# EAGLE design microsd (EAGLE 9.1.0)

## Sheet 1 of 2
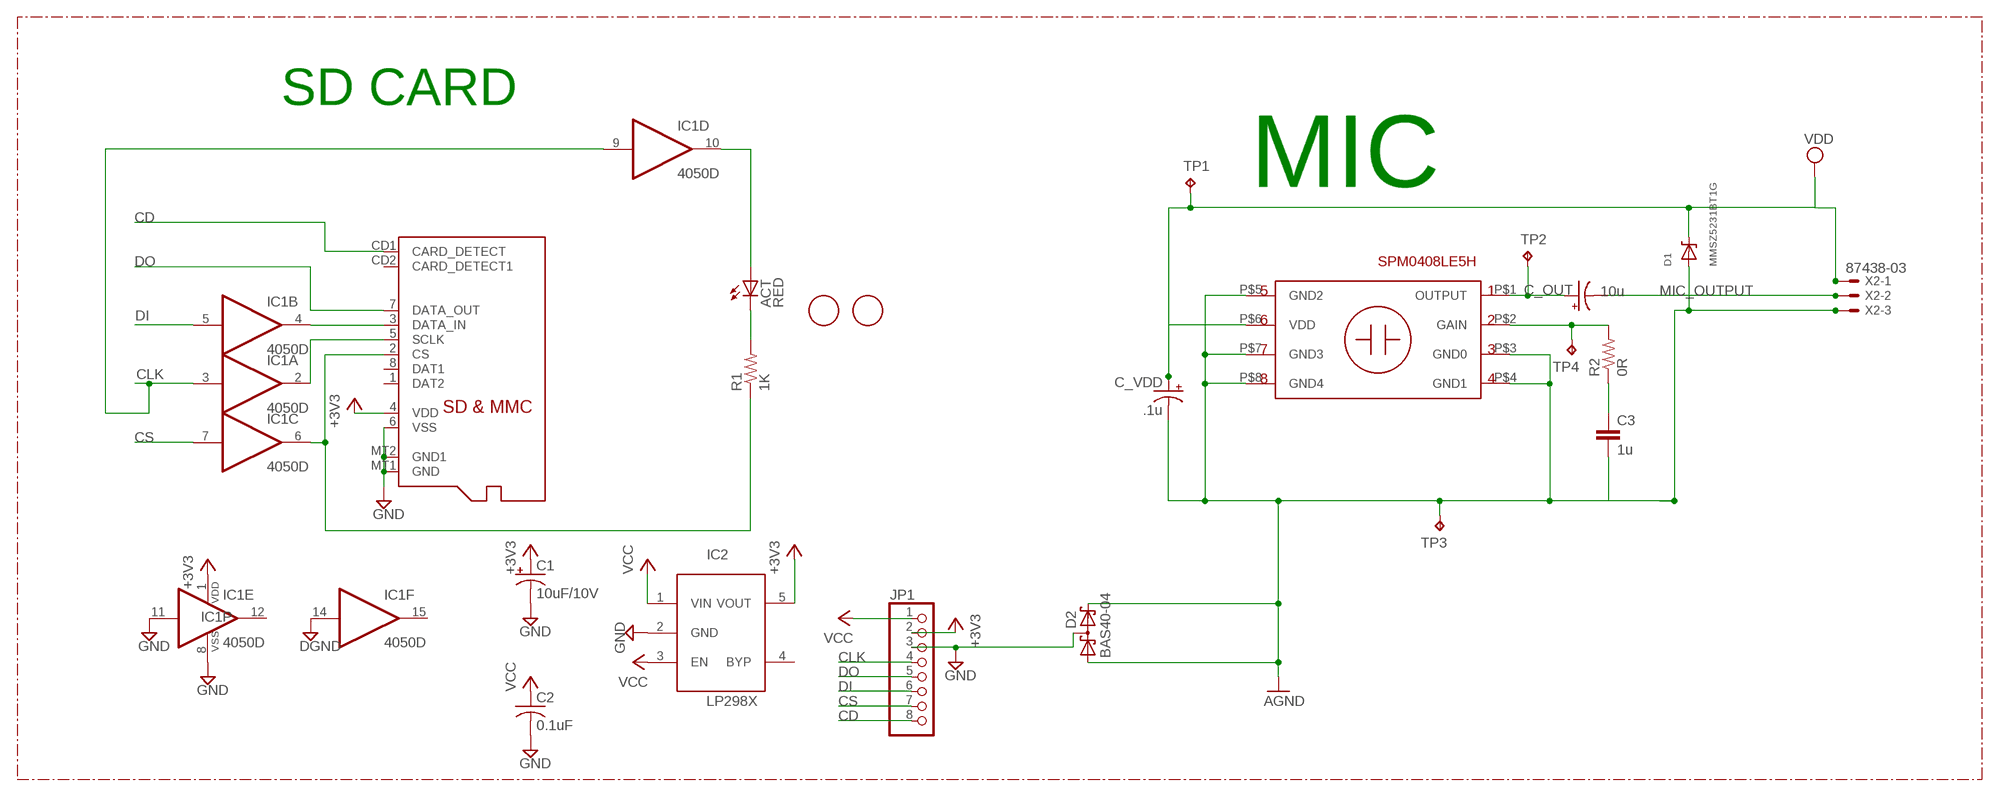
[diagram p0: schematic, sheet 1]

### Parts
ACT  RED  LEDCHIP-LED0805  [CHIP-LED0805]
C1  10uF/10V  CPOL-USA/3216-18R  [A/3216-18R]
C2  0.1uF  C-USC0805K  [C0805K]
C3  1u  CAP_0402  [0402]
C_OUT  10u  CAP_POL1206-KIT  [EIA3216-KIT]
C_VDD  .1u  CAP_POL1206-KIT  [EIA3216-KIT]
D1  MMSZ5231BT1G  DIODE-ZENERSOD123  [SOD-123]
D2  BAS40-04  [SOT23]
IC1  4050D  [SO16]
IC2  LP298XS  [SOT23-5L]
JP1  PINHD-1X8BIG  [1X08-BIG]
R1  1K  R-US_R0805  [R0805]
R2  0R  RES_0402  [0402]
TP1  TPPAD1-17  [P1-17]
TP2  TPPAD1-17  [P1-17]
TP3  TPPAD1-17  [P1-17]
TP4  TPPAD1-17  [P1-17]
U2  SPM0408LE5H  [SPM0408LE5H-TB]
U$1  FIDUCIAL  [FIDUCIAL_1MM]
U$2  FIDUCIAL  [FIDUCIAL_1MM]
X1  MICROSD  [MICROSD]
X2  87438-03  [87438-03]

### Nets
+3V3: C1.+ IC1.1(P:VDD) IC2.5(VOUT) JP1.2 X1.4(VDD)
AGND: C3.2 C_VDD.C(-) D1.A D2.1(A1) D2.2(C2) TP3.TP U2.P$3(GND0) U2.P$4(GND1) U2.P$5(GND2) U2.P$7(GND3) U2.P$8(GND4) X2.3
CD: JP1.8 X1.CD1(CARD_DETECT)
CLK: IC1.3(A:I) IC1.9(D:I) JP1.4
CS: IC1.7(C:I) JP1.7
DI: IC1.5(B:I) JP1.6
DO: JP1.5 X1.7(DATA_OUT)
GND: C1.- C2.2 D2.3(C1A2) IC1.8(P:VSS) IC1.11(E:I) IC1.14(F:I) IC2.2(GND) JP1.3 X1.6(VSS) X1.MT1(GND) X1.MT2(GND1) ; supply symbol labelled DGND
MIC_OUTPUT: C_OUT.C(-) X2.2
N$1: ACT.A IC1.10(D:O)
N$2: IC1.2(A:O) X1.5(SCLK)
N$3: IC1.6(C:O) R1.1 X1.2(CS)
N$4: ACT.C R1.2
N$5: IC1.4(B:O) X1.3(DATA_IN)
N$8: C_OUT.A(+) TP2.TP U2.P$1(OUTPUT)
N$35: R2.2 TP4.TP U2.P$2(GAIN)
N$36: C3.1 R2.1
VCC: C2.1 IC2.1(VIN) IC2.3(EN) JP1.1
VDD: C_VDD.A(+) D1.C TP1.TP U2.P$6(VDD) X2.1
Unconnected: IC1.12(E:O) IC1.15(F:O) IC2.4(BYP) X1.1(DAT2) X1.8(DAT1) X1.CD2(CARD_DETECT1)

### Notes on the sheet
- SD CARD
- MIC
- SPM0408LE5H

## Sheet 2 of 2

## Library data of the parts
ACT = adafruit:LED: LED OSRAM: - CHIPLED LG R971, LG N971, LY N971, LG Q971, LY Q971, LO R971, LY R971 LH N974, LH R974 LS Q976, LO Q976, LY Q976 LO Q996 - Hyper CHIPLED LW Q18S LB Q993, LB Q99A, LB R99A - SideLED LS A670, LO A670, LY A670, LG A670, LP A670 LB A673, LV A673, LT A673, LW A673 LH A674 LY A675 LS A676, LA A676, LO A676, LY A676, LW A676 LS A679, LY A679, LG A679 - Hyper Micro SIDELED® LS Y876, LA Y876, LO Y876, LY Y876 LT Y87S - SmartLED LW L88C, LW L88S LB L89C, LB L89S, LG L890 LS L89K, LO L89K, LY L89K LS L896, LA L896, LO L896, LY L896 - TOPLED LS T670, LO T670, LY T670, LG T670, LP T670 LSG T670, LSP T670, LSY T670, LOP T670, LYG T670 LG T671, LOG T671, LSG T671 LB T673, LV T673, LT T673, LW T673 LH T674 LS T676, LA T676, LO T676, LY T676, LB T676, LH T676, LSB T676, LW T676 LB T67C, LV T67C, LT T67C, LS T67K, LO T67K, LY T67K, LW E67C LS E67B, LA E67B, LO E67B, LY E67B, LB E67C, LV E67C, LT E67C LW T67C LS T679, LY T679, LG T679 LS T770, LO T770, LY T770, LG T770, LP T770 LB T773, LV T773, LT T773, LW T773 LH T774 LS E675, LA E675, LY E675, LS T675 LS T776, LA T776, LO T776, LY T776, LB T776 LHGB T686 LT T68C, LB T68C - Hyper Mini TOPLED® LB M676 - Mini TOPLED Santana® LG M470 LS M47K, LO M47K, LY M47K Source: http://www.osram.convergy.de/
C1 = adafruit:CPOL-US: POLARIZED CAPACITOR, American symbol
C2 = adafruit:C-US: CAPACITOR, American symbol
C3 = Perfect_0402:CAP_0402: 0402 (1005 Metric) Nick Garner - TeleSense
C_OUT = SparkFun-Passives:CAP_POL: Capacitor Polarized These are standard SMD and PTH capacitors. Normally 10uF, 47uF, and 100uF in electrolytic and tantalum varieties. Always verify the external diameter of the through hole cap, it varies with capacity, voltage, and manufacturer. The EIA devices should be standard.; MF: AVX; MPN: 0603ZD106MAT2A; OC_FARNELL: 1867954
C_VDD = SparkFun-Passives:CAP_POL: Capacitor Polarized These are standard SMD and PTH capacitors. Normally 10uF, 47uF, and 100uF in electrolytic and tantalum varieties. Always verify the external diameter of the through hole cap, it varies with capacity, voltage, and manufacturer. The EIA devices should be standard.; MF: VISHAY SPRAGUE; MPN: 293D106X96R3A2TE3; OC_FARNELL: 1754143
D1 = microbuilder:DIODE-ZENER: Zener Diode SMA: 30V 1W Zener Diode, 1.2Vf - Digikey: SMAZ30-FDICT-ND
D2 = diode:BAS40-04: Silicon Schottky Diodes General-purpose diode for high-speed switching
IC1 = 40xx:4050: Hex non-inverting BUFFER
IC2 = adafruit:LP298X
JP1 = adafruit:PINHD-1X8: PIN HEADER
R1 = adafruit:R-US_: RESISTOR, American symbol
R2 = Perfect_0402:RES_0402: 0402 (1005 Metric) Nick Garner - TeleSense
TP1-TP4 = testpad:TP: Test pad
U2 = acousticLib:SPM0408LE5H
U$1 U$2 = adafruit:FIDUCIAL: For use by pick and place machines to calibrate the vision/machine, 1mm By microbuilder.eu
X1 = adafruit:MICROSD: Micro-SD / Transflash card holder with SPI pinout For the 3M # 2908-05WB-MG and/or 4UCON #19656 push-push type
X2 = con-molex:87438-03: Wire-to-Board 1.50mm (.059") Pitch Header - Right Angle, SMT, Shrouded Source: http://www.molex.com/product/micro/87438.html; MF: MOLEX; OC_FARNELL: 1711328; OC_NEWARK: unknown

## Net classes
0 default: width 0.152 mm, drill 0.305 mm, clearance 0.152 mm

## Board
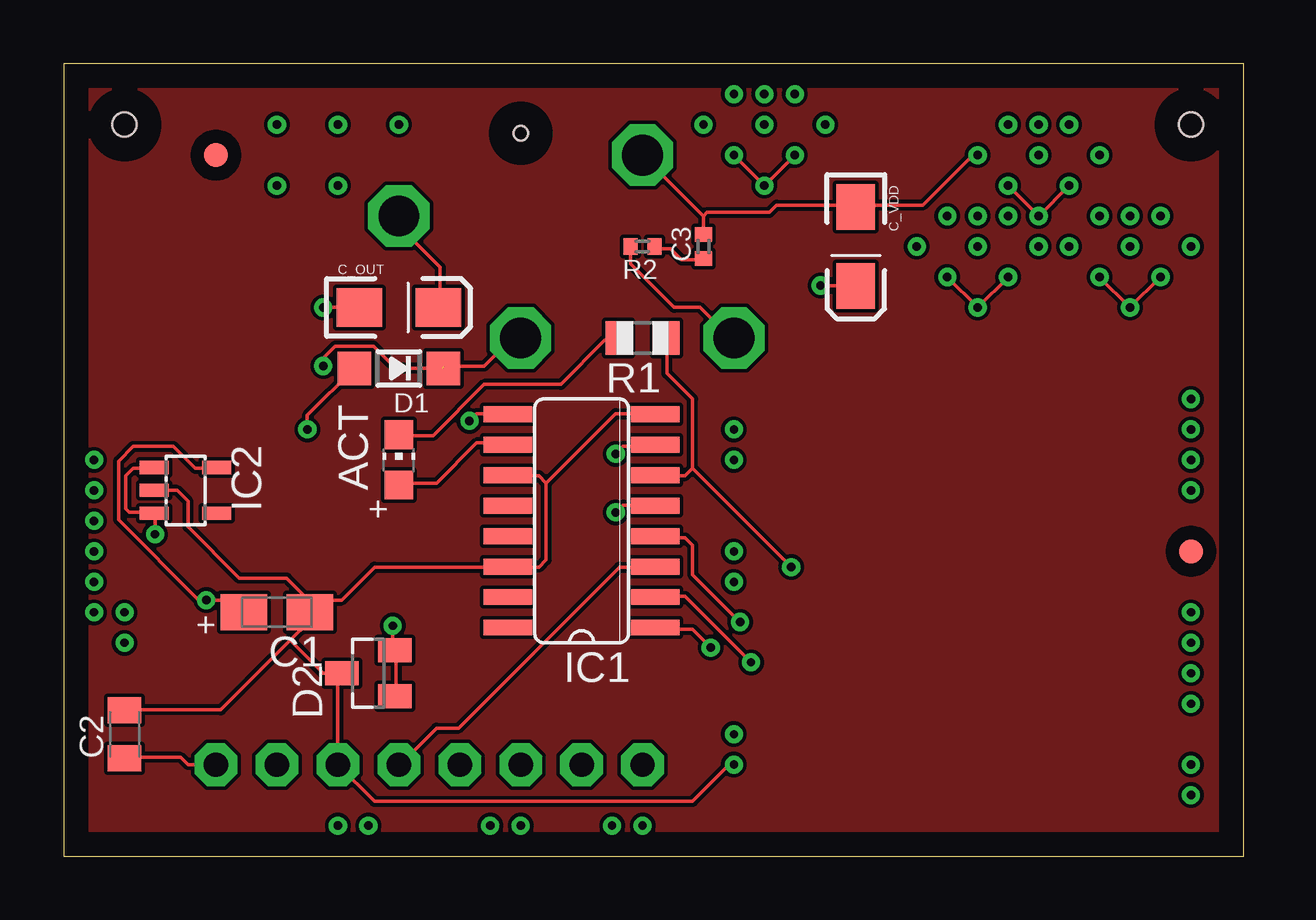
[diagram p1: board, top side]
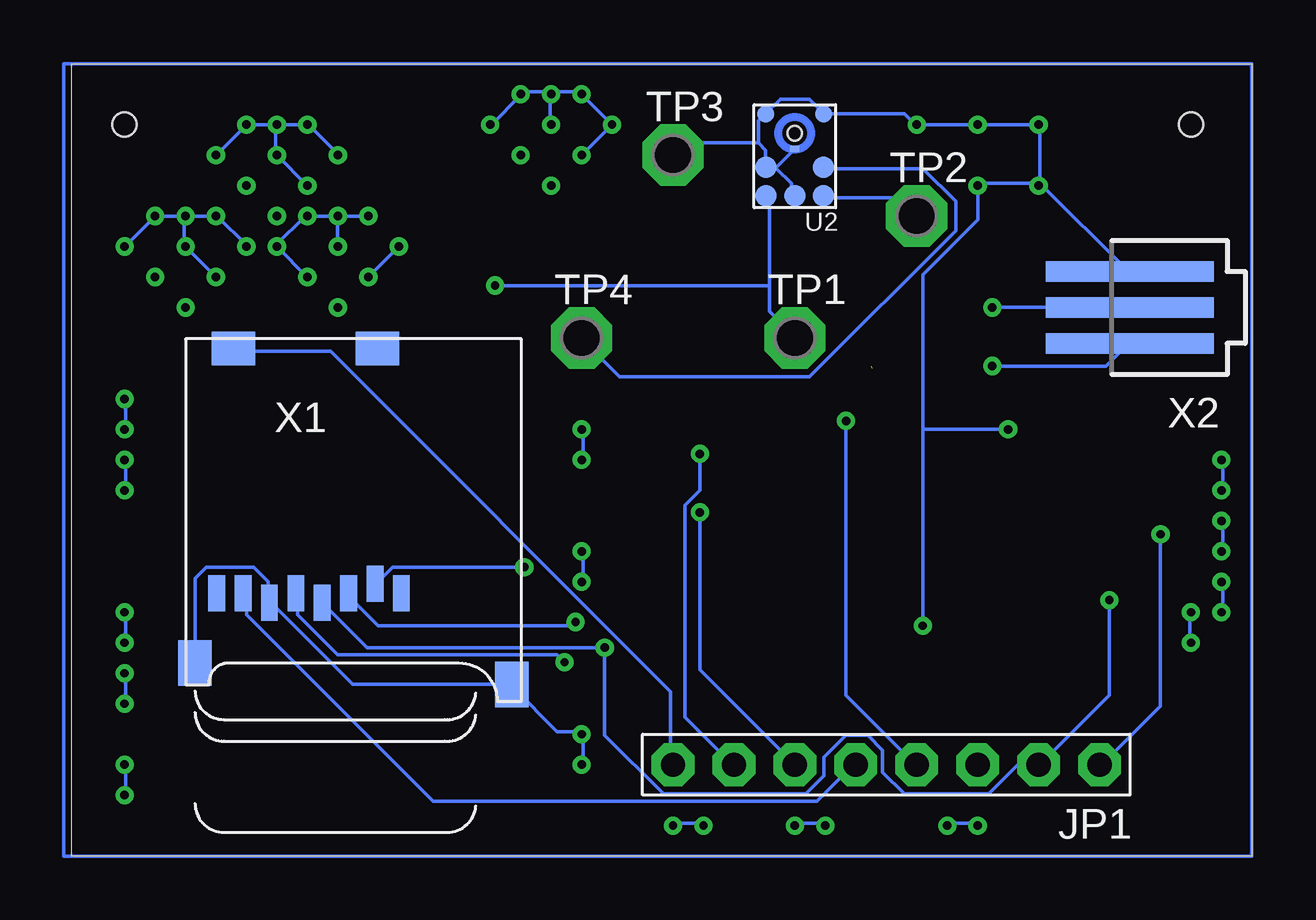
[diagram p2: board, bottom side, seen from below]

Size 49.2 x 33.01 mm. Coordinates in mm from the lower left corner, seen from the top.
Outline: 0,0 49.2,0 49.2,33.01 0,33.01 0,0
Copper layers (1*16): Top 0.035mm / dielectric 1.5mm / Bottom 0.035mm
Design rules "default": minimum track width 6mil, minimum drill 0.35mm, track to track 6mil, track to pad 6mil, pad to pad 6mil, via to via 6mil, smd to smd 6mil, copper to edge 40mil, drill to drill 6mil, minimum pad ring 10mil, minimum via ring 8mil, stop-mask expansion 4mil, vias tented up to drill 0mil, thermal gap 10mil
Holes 1 mm at 46.99,30.48 2.54,30.48

### Footprints (pad centres in the part's own frame; a part is rotated, then mirrored left to right if it is on the bottom)
CHIP-LED0805 = smd 1.2 x 1.2: A 0,-1.05; C 0,1.05
A/3216-18R = smd 1.95 x 1.5: + 1.375,0; - -1.375,0
C0805K = smd 1.1 x 1.4: 1 -1,0; 2 1,0
0402 = smd 0.6 x 0.7: 1 -0.5,0; 2 0.5,0
EIA3216-KIT = smd 1.9 x 1.6: A 1.65,0; C -1.65,0
SOD-123 = smd 1.4 x 1.4: A 1.85,0; C -1.85,0
SOT23 = smd 1 x 1.4: 1 -0.95,-1.1; 2 0.95,-1.1; 3 0,1.1
SO16 = smd 0.66 x 2.032: 1 -4.445,-3.073; 2 -3.175,-3.073; 3 -1.905,-3.073; 4 -0.635,-3.073; 5 0.635,-3.073; 6 1.905,-3.073; 7 3.175,-3.073; 8 4.445,-3.073; 9 4.445,3.073; 10 3.175,3.073; 11 1.905,3.073; 12 0.635,3.073; 13 -0.635,3.073; 14 -1.905,3.073; 15 -3.175,3.073; 16 -4.445,3.073
SOT23-5L = smd 0.55 x 1.2: 1 -0.95,-1.3; 2 0,-1.3; 3 0.95,-1.3; 4 0.95,1.3; 5 -0.95,1.3
1X08-BIG = drill 1.016 pad 1.778 octagon: 1 -8.89,0; 2 -6.35,0; 3 -3.81,0; 4 -1.27,0; 5 1.27,0; 6 3.81,0; 7 6.35,0; 8 8.89,0
R0805 = smd 1.1 x 1.4: 1 -1,0; 2 1,0
P1-17 = drill 1.702 pad 2.54 octagon: TP 0,0
SPM0408LE5H-TB = smd 0.9 x 0.9: P$1 -1.2,1.7; P$2 -1.2,0.506; P$5 1.208,0.506; P$6 1.208,1.7; P$7 0.004,1.7 | smd 0.7 x 0.7: P$3 -1.2,-1.706; P$4 1.208,-1.706 | smd 0.406 x 0.203: P$8 0,-0.26 | hole 0.6: 0.004,-0.916
FIDUCIAL_1MM = smd 1 x 1: 1 0,0
MICROSD = smd 0.7 x 1.5: 1 9,-10.64; 2 7.9,-10.24; 3 6.8,-10.64; 4 5.7,-11.04; 5 4.6,-10.64; 6 3.5,-11.04; 7 2.4,-10.64; 8 1.3,-10.64 | smd 1.8 x 1.4: CD1 2,-0.44; CD2 8,-0.44 | smd 1.4 x 1.9: MT1 0.4,-13.54; MT2 13.6,-14.44
87438-03 = smd 7 x 0.85: 1 0,1.5; 2 0,0; 3 0,-1.5

### Placement (x,y rotation side)
ACT  13.97,16.51 0 top
C1  8.89,10.16 180 top
C2  2.54,5.08 90 top
C3  26.67,25.4 90 top
C_OUT  13.97,22.86 0 top
C_VDD  33.02,25.4 270 top
D1  13.97,20.32 180 top
D2  12.7,7.62 90 top
IC1  21.59,13.97 90 top
IC2  5.08,15.24 270 top
JP1  15.24,3.81 180 bottom
R1  24.13,21.59 180 top
R2  24.13,25.4 180 top
TP1  19.05,21.59 0 bottom
TP2  13.97,26.67 0 bottom
TP3  24.13,29.21 0 bottom
TP4  27.94,21.59 0 bottom
U2  19.05,29.21 180 bottom
U$1  6.35,29.21 0 top
U$2  46.99,12.7 0 top
X1  44.45,21.59 0 bottom
X2  5.08,22.86 180 bottom

### Tracks (layer width: path | path; a pad name or v marks a point on that pad's centre or on a via)
+3V3  (via drill 0.35)
  Top 0.152: IC2.5 6.25,16.15 5.49,16.15 4.57,17.07 2.9,17.07 2.29,16.46 2.29,14.02 5.64,10.67 v5.94,10.67 7.01,10.67 7.47,10.21 C1.+ | v26.98,8.69 26.21,9.45 24.69,9.45 IC1.1
  Bottom 0.152: X1.4 38.71,10.52 36.88,8.69 v26.98,8.69 26.98,5.03 24.54,2.59 18.59,2.59 17.83,3.35 17.83,4.12 16.92,5.03 16,5.03 15.39,4.42 15.39,3.5 14.48,2.59 10.97,2.59 9.75,3.81 JP1.2 8.84,3.81 5.94,6.71 v5.94,10.67
AGND  (via drill 0.35)
  Top 0.152: v39.37,27.94 v40.64,26.67 v41.91,27.94 | v38.1,29.21 38.1,29.11 37.8,29.11 35.81,27.13 33.07,27.13 C_VDD.C 32.92,27.13 29.72,27.13 29.41,26.82 26.82,26.82 26.67,26.67 | 26.67,26.67 C3.2 | TP3.TP 26.67,26.67 | D2.1 13.87,6.71 13.87,8.53 D2.2 13.72,8.69 v13.72,9.6 | D1.A 10.16,18.36 v10.16,17.78
  Bottom 0.152: U2.P$8 19.82,28.7 U2.P$5 | v43.18,29.21 v41.91,30.48 40.69,30.48 | 40.69,30.48 40.69,29.26 v40.64,29.21 v39.37,27.94 | v38.1,29.21 38.1,29.26 39.32,30.48 v39.37,30.48 v40.64,30.48 40.69,30.48 | U2.P$7 19.2,27.58 19.2,28.04 19.81,28.65 U2.P$5 | 17.83,30.94 18.44,31.55 19.66,31.55 20.27,30.94 | 20.57,29.72 20.27,29.41 20.27,28.8 U2.P$5 | 20.57,29.72 20.57,30.63 20.27,30.94 | 20.27,30.94 U2.P$4 | 20.57,29.72 23.62,29.72 TP3.TP | 8.84,28.04 8.84,30.48 v8.89,30.48 v11.43,30.48 v13.97,30.48 14.02,30.48 14.48,30.94 17.83,30.94 | 13.72,17.78 13.72,24.23 11.43,26.52 v11.43,27.94 11.43,28.04 8.99,28.04 v8.89,27.94 8.84,28.04 | 13.72,17.78 v13.72,9.6 | 8.84,28.04 5.18,24.38 X2.3 | 17.83,30.94 U2.P$3 | v10.16,17.78 13.72,17.78
AGND1  (via drill 0.35)
  Top 0.152: v43.18,24.13 v44.45,22.86 v45.72,24.13
  Bottom 0.152: v46.99,25.4 v45.72,26.67 44.5,26.67 | 44.5,26.67 44.5,25.45 v44.45,25.4 v43.18,24.13 | v41.91,25.4 41.91,25.45 43.13,26.67 v43.18,26.67 v44.45,26.67 44.5,26.67
AGND2  (via drill 0.35)
  Top 0.152: v36.83,24.13 v38.1,22.86 v39.37,24.13
  Bottom 0.152: v38.1,26.67 v38.1,25.4 | v38.1,26.67 v36.83,26.67 | v38.1,26.67 v39.37,26.67 39.47,26.67 40.69,25.45 v40.64,25.4 v39.37,24.13 | v36.83,24.13 v35.56,25.4
AGND3  (via drill 0.35)
  Top 0.152: v27.94,29.21 v29.21,27.94 v30.48,29.21
  Bottom 0.152: v31.75,30.48 31.7,30.48 30.48,31.7 v30.48,31.75 30.48,31.85 29.26,31.85 v29.21,31.75 | v29.21,30.48 29.26,30.48 29.26,31.7 v29.21,31.75 | v29.21,31.75 29.11,31.85 28.04,31.85 v27.94,31.75 v26.67,30.48 v27.94,29.21
CD
  Bottom 0.152: X1.CD1 42.37,21.03 38.41,21.03 24.23,6.86 24.23,3.81 JP1.8
CLK  (via drill 0.35)
  Top 0.152: IC1.3 24.54,12.04 23.16,12.04 16.46,5.33 15.54,5.33 14.02,3.81 JP1.4 | v16.92,18.14 17.22,18.44 18.44,18.44 IC1.9
  Bottom 0.152: v16.92,18.14 16.92,6.71 14.02,3.81 JP1.4
CS  (via drill 0.35)
  Top 0.152: v23.01,16.76 23.32,17.07 24.54,17.07 IC1.7
  Bottom 0.152: v23.01,16.76 23.01,15.24 23.62,14.63 23.62,5.79 21.64,3.81 JP1.7
DI  (via drill 0.35)
  Top 0.152: v23.01,14.33 23.32,14.63 24.54,14.63 IC1.5
  Bottom 0.152: v23.01,14.33 23.01,7.77 JP1.6
DO
  Bottom 0.152: X1.7 41.91,10.82 41.91,10.06 34.14,2.29 18.14,2.29 16.61,3.81 JP1.5
GND  (via drill 0.35)
  Top 0.152: 20.12,15.54 20.12,12.34 19.81,12.04 18.59,12.04 IC1.14 18.44,12.04 12.95,12.04 11.58,10.67 10.21,10.67 | 20.12,15.54 19.81,15.85 18.59,15.85 IC1.11 | 20.12,15.54 23.01,18.44 24.54,18.44 IC1.8 | IC2.2 4.72,15.24 5.18,14.78 5.18,13.72 7.32,11.58 9.3,11.58 10.21,10.67 | 10.21,10.67 10.21,10.21 C1.- | 9.45,8.99 10.21,9.75 10.21,10.06 C1.- | 9.45,8.99 6.55,6.1 2.59,6.1 C2.2 | 11.43,7.62 10.82,7.62 9.45,8.99 | 11.43,7.62 D2.3 11.58,7.62 | 11.43,7.62 JP1.3 12.95,2.29 26.21,2.29 27.74,3.81 v27.94,3.81 | 10.21,10.67 C1.-
  Bottom 0.152: v27.94,3.81 27.89,3.81 27.89,5.03 v27.94,5.08 28.04,5.18 28.96,5.18 30.79,7.01 X1.MT2 30.94,7.16 37.49,7.16 40.84,10.52 X1.6 41,10.67 41,11.43 41.6,12.04 43.59,12.04 44.04,11.58 44.04,8.08 X1.MT1
GND1  (via drill 0.35)
  Bottom 0.152: v27.94,16.51 27.89,16.61 27.89,17.68 v27.94,17.78
GND2  (via drill 0.35)
  Bottom 0.152: v27.94,11.43 27.89,11.43 27.89,12.65 v27.94,12.7
GND3  (via drill 0.35)
  Bottom 0.152: v46.99,17.78 46.94,17.83 46.94,19.05 v46.99,19.05
GND4  (via drill 0.35)
  Bottom 0.152: v46.99,6.35 46.94,6.4 46.94,7.62 v46.99,7.62
GND5  (via drill 0.35)
  Bottom 0.152: v46.99,2.54 46.94,2.59 46.94,3.81 v46.99,3.81
GND6  (via drill 0.35)
  Bottom 0.152: v17.78,1.27 17.83,1.37 19.05,1.37 v19.05,1.27
GND7  (via drill 0.35)
  Bottom 0.152: v22.86,1.27 22.86,1.37 24.08,1.37 v24.13,1.27
GND8  (via drill 0.35)
  Bottom 0.152: v11.43,1.27 11.43,1.37 12.65,1.37 v12.7,1.27
GND9  (via drill 0.35)
  Bottom 0.152: v2.54,8.89 2.59,8.99 2.59,10.06 v2.54,10.16
GND10  (via drill 0.35)
  Bottom 0.152: v1.27,12.7 1.22,12.8 1.22,13.87 v1.27,13.97
GND11  (via drill 0.35)
  Bottom 0.152: v1.27,15.24 1.22,15.24 1.22,16.46 v1.27,16.51
GND12  (via drill 0.35)
  Bottom 0.152: v1.27,10.16 1.22,10.21 1.22,11.43 v1.27,11.43
GND13  (via drill 0.35)
  Bottom 0.152: v46.99,15.24 46.94,15.24 46.94,16.46 v46.99,16.51
GND14  (via drill 0.35)
  Bottom 0.152: v46.99,8.89 46.94,8.99 46.94,10.06 v46.99,10.16
MIC_OUTPUT  (via drill 0.35)
  Top 0.152: v10.82,22.86 C_OUT.C
  Bottom 0.152: X2.2 v10.82,22.86
N$1
  Top 0.152: ACT.A 14.02,15.54 15.54,15.54 17.22,17.22 18.44,17.22 IC1.10
N$2  (via drill 0.35)
  Top 0.152: v28.65,8.08 25.91,10.82 24.69,10.82 IC1.2
  Bottom 0.152: v28.65,8.08 28.96,8.38 38.1,8.38 39.78,10.06 39.78,10.82 X1.5
N$3  (via drill 0.35)
  Top 0.152: 26.21,16.15 26.21,19.05 25.15,20.12 25.15,21.49 R1.1 | 26.21,16.15 25.91,15.85 24.69,15.85 IC1.6 | 26.21,16.15 v30.33,12.04
  Bottom 0.152: v30.33,12.04 35.81,12.04 36.42,11.43 X1.2
N$4
  Top 0.152: ACT.C 14.02,17.53 15.39,17.53 17.53,19.66 20.73,19.66 22.55,21.49 23.01,21.49 R1.2
N$5  (via drill 0.35)
  Top 0.152: v28.19,9.75 26.21,11.73 26.21,12.95 25.91,13.26 24.69,13.26 IC1.4
  Bottom 0.152: v28.19,9.75 28.35,9.6 36.42,9.6 37.64,10.82 X1.3
N$7
  pour Top: 0,33.02 49.53,33.02 49.53,0 0,0
N$8
  Top 0.152: C_OUT.A 15.7,22.86 15.7,24.54 14.02,26.21 14.02,26.67 TP2.TP
  Bottom 0.152: U2.P$1 17.83,27.43 14.78,27.43 14.02,26.67 TP2.TP
N$9
  Bottom 0.152: 0,33.02 49.53,33.02 49.53,0 0,0 0,33.02
N$35
  Top 0.152: R2.2 23.62,25.3 23.62,24.69 25.45,22.86 26.52,22.86 27.89,21.49 TP4.TP
  Bottom 0.152: U2.P$2 17.83,28.65 13.72,28.65 12.34,27.28 12.34,26.06 18.44,19.96 26.36,19.96 27.89,21.49 TP4.TP
N$36
  Top 0.152: C3.1 26.67,24.84 25.76,24.84 25.3,25.3 24.69,25.3 R2.1
VCC  (via drill 0.35)
  Top 0.152: IC2.1 3.66,16.15 2.9,16.15 2.59,15.85 2.59,14.48 2.74,14.33 3.66,14.33 IC2.3 3.81,14.17 v3.81,13.41 | JP1.1 5.18,3.81 4.88,4.12 2.59,4.12 C2.1
  Bottom 0.152: v3.81,13.41 3.81,6.25 6.25,3.81 JP1.1
VDD  (via drill 0.35)  (1 unrouted)
  Top 0.152: 15.85,20.42 17.53,20.42 18.59,21.49 19.05,21.49 TP1.TP | v31.55,23.77 32.92,23.77 C_VDD.A | D1.C 13.84,20.32 12.91,21.25 11.32,21.25 10.82,20.74 v10.82,20.42
  Bottom 0.152: v10.82,20.42 6.1,20.42 5.18,21.34 X2.1 | 20.12,23.77 20.12,22.71 19.05,21.64 TP1.TP | 20.12,23.77 20.12,27.43 U2.P$6 | 20.12,23.77 v31.55,23.77